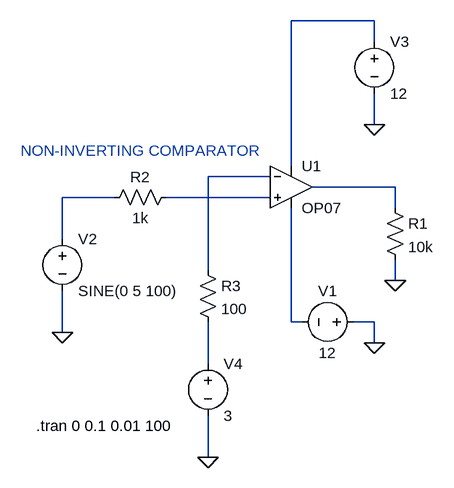
[diagram p0: schematic Non-Inverting Comparator.asc]
Non-Inverting Comparator.asc, the LTspice schematic file:
Version 4
SHEET 1 880 680
WIRE 400 -48 272 -48
WIRE 400 -16 400 -48
WIRE 400 112 400 64
WIRE 272 176 272 -48
WIRE 240 192 144 192
WIRE 432 208 304 208
WIRE 0 224 -80 224
WIRE 240 224 80 224
WIRE 432 240 432 208
WIRE -80 288 -80 224
WIRE 144 336 144 192
WIRE 432 352 432 320
WIRE 272 416 272 240
WIRE 288 416 272 416
WIRE 400 416 368 416
WIRE -80 432 -80 368
WIRE 400 448 400 416
WIRE 144 480 144 416
WIRE 144 624 144 560
FLAG 432 352 0
FLAG 400 448 0
FLAG -80 432 0
FLAG 400 112 0
FLAG 144 624 0
SYMBOL OpAmps\\OP07 272 144 R0
SYMATTR InstName U1
SYMBOL res 416 224 R0
SYMATTR InstName R1
SYMATTR Value 10k
SYMBOL voltage 384 416 M270
WINDOW 0 32 56 VTop 2
WINDOW 3 -32 56 VBottom 2
WINDOW 123 0 0 Left 0
WINDOW 39 0 0 Left 0
SYMATTR InstName V1
SYMATTR Value 12
SYMBOL res 96 208 R90
WINDOW 0 0 56 VBottom 2
WINDOW 3 32 56 VTop 2
SYMATTR InstName R2
SYMATTR Value 1k
SYMBOL voltage -80 272 R0
WINDOW 123 0 0 Left 0
WINDOW 39 0 0 Left 0
SYMATTR InstName V2
SYMATTR Value SINE(0 5 100)
SYMBOL voltage 400 -32 R0
WINDOW 123 0 0 Left 0
WINDOW 39 0 0 Left 0
SYMATTR InstName V3
SYMATTR Value 12
SYMBOL res 128 320 R0
SYMATTR InstName R3
SYMATTR Value 100
SYMBOL voltage 144 464 R0
WINDOW 123 0 0 Left 0
WINDOW 39 0 0 Left 0
SYMATTR InstName V4
SYMATTR Value 3
TEXT -120 576 Left 2 !.tran 0 0.1 0.01 100
TEXT -144 152 Left 2 ;NON-INVERTING COMPARATOR

The netlist it stands for:
* Non-Inverting Comparator.asc
XU1 N005 N002 N001 N006 N003 LT1001  ; OP07, pins In+ In- V+ V- OUT
R1 N003 0 10k
V1 0 N006 12
R2 N005 N004 1k
V2 N004 0 SINE(0 5 100)
V3 N001 0 12
R3 N002 N007 100
V4 N007 0 3
.tran 0 0.1 0.01 100
* NON-INVERTING COMPARATOR
.lib LTC.lib
.backanno
.end